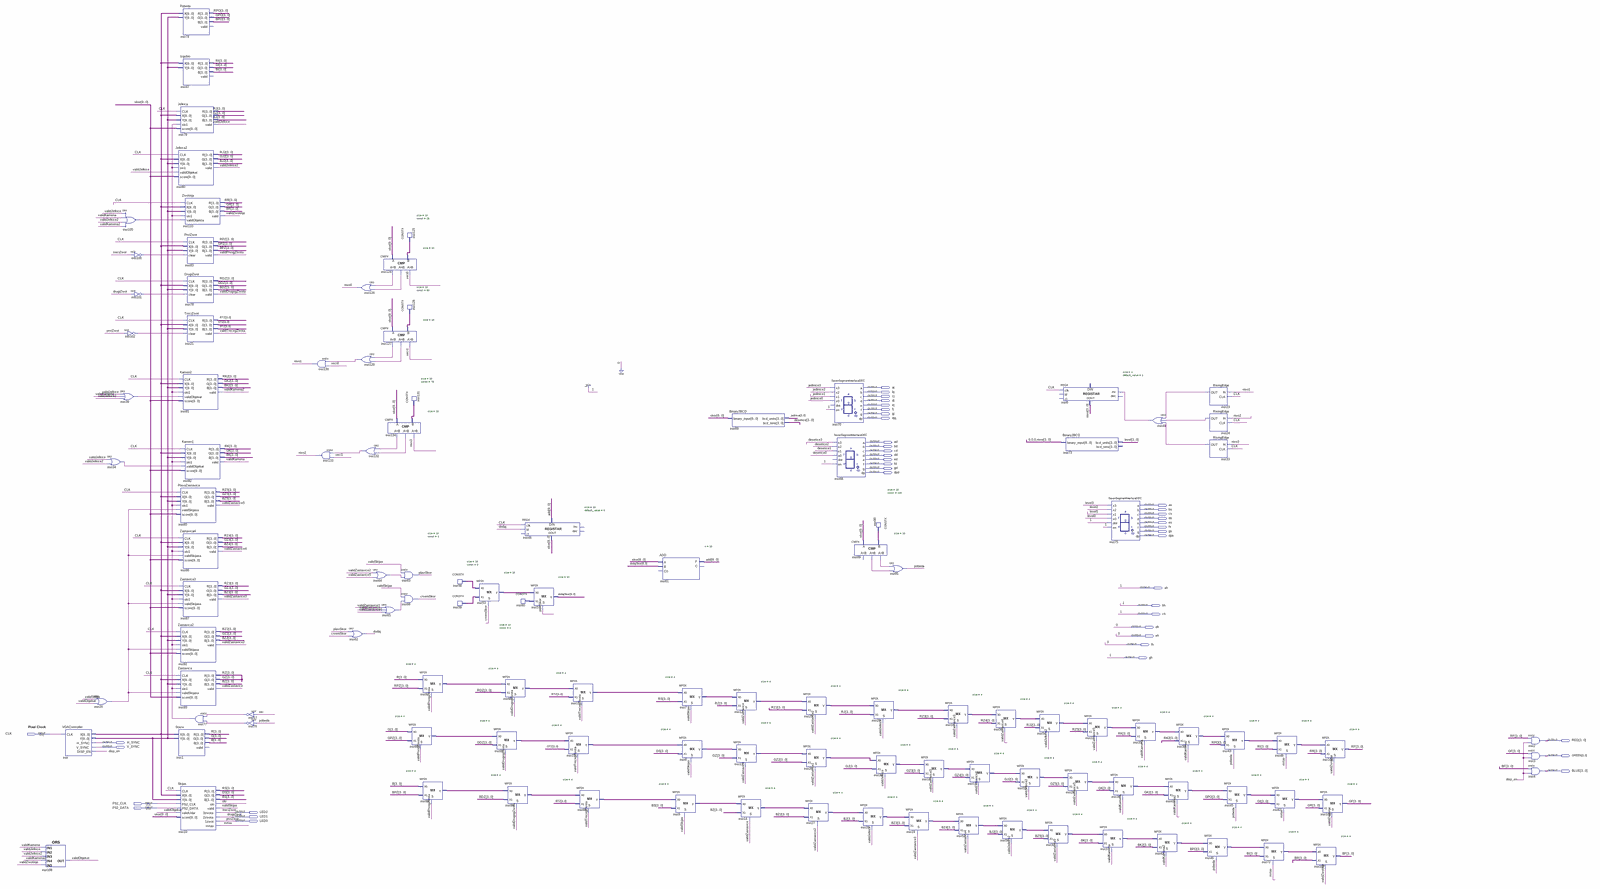
[diagram p0: schematic sheet, whole]
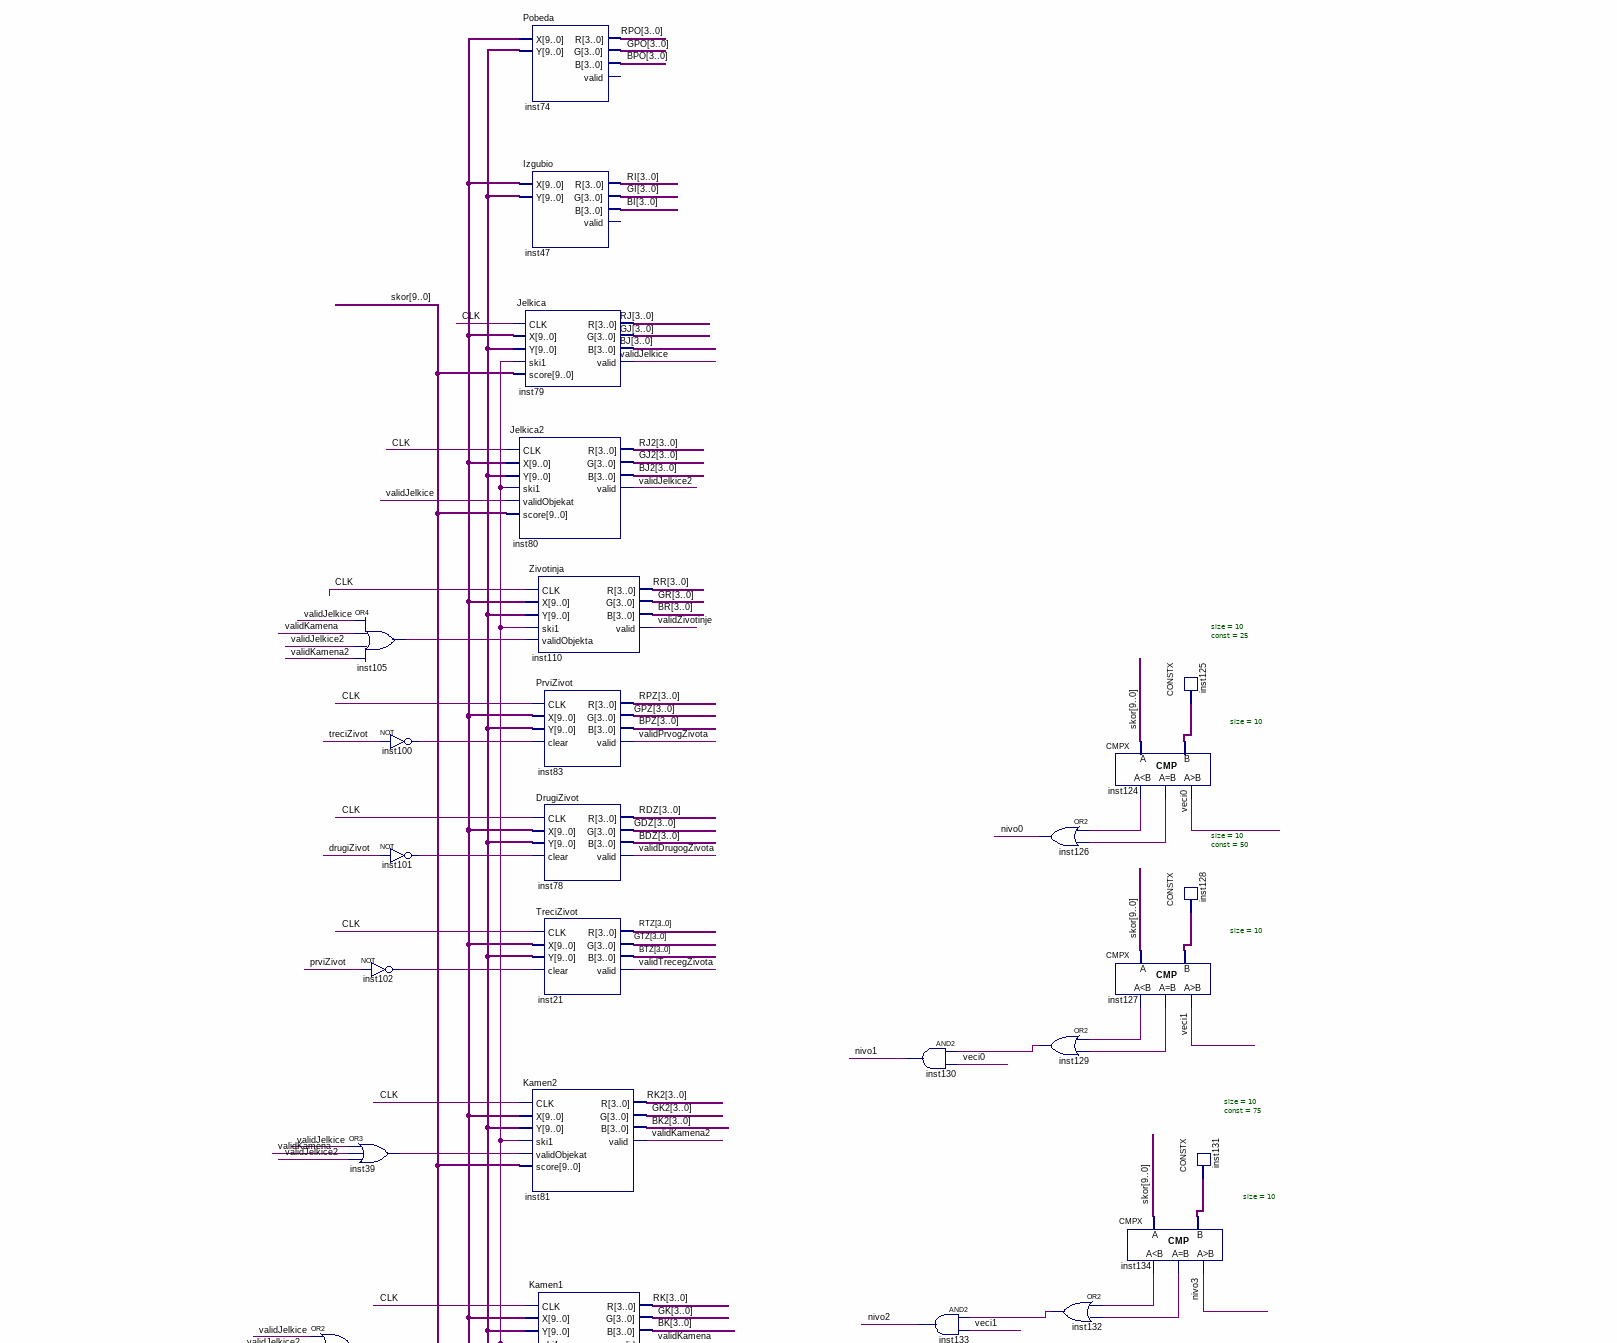
[diagram p1: schematic sheet, upper left part]
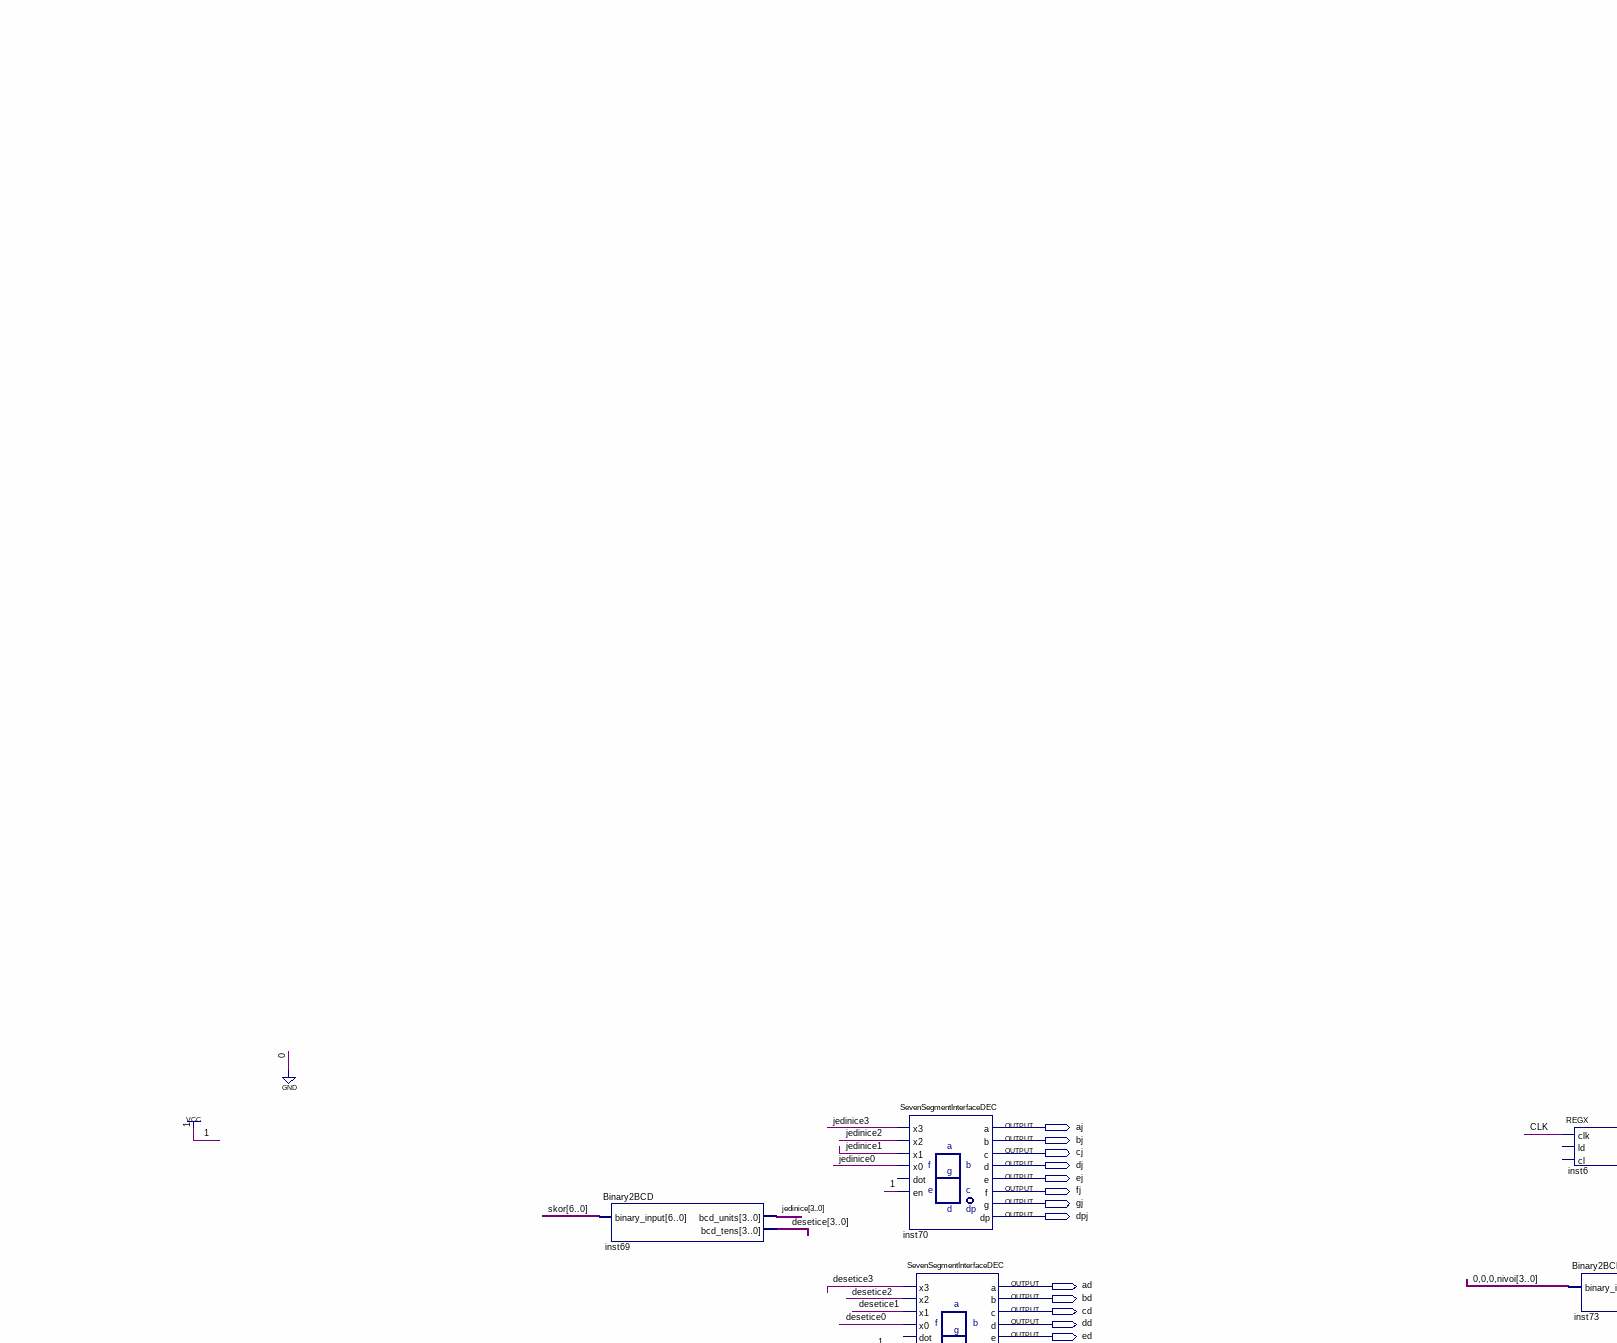
[diagram p2: schematic sheet, upper centre part]
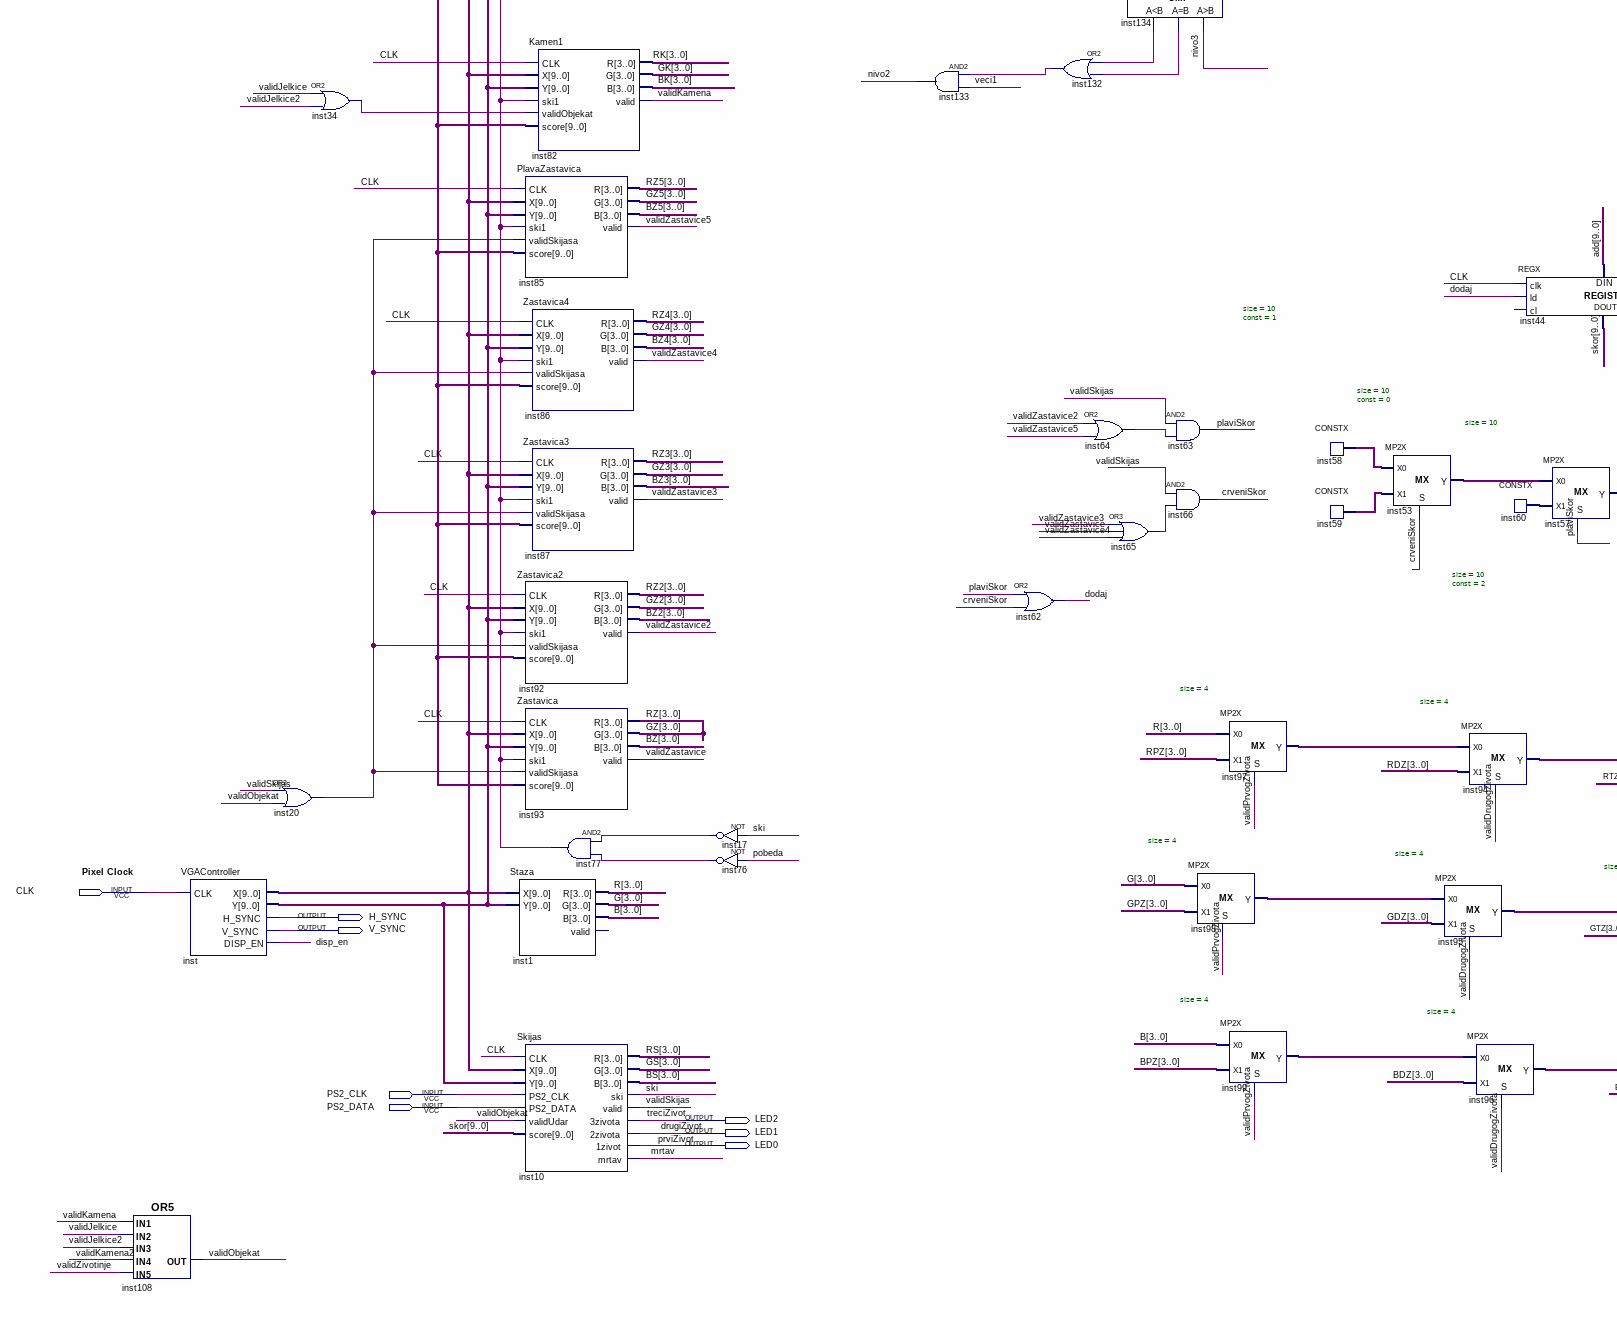
[diagram p3: schematic sheet, lower left part]
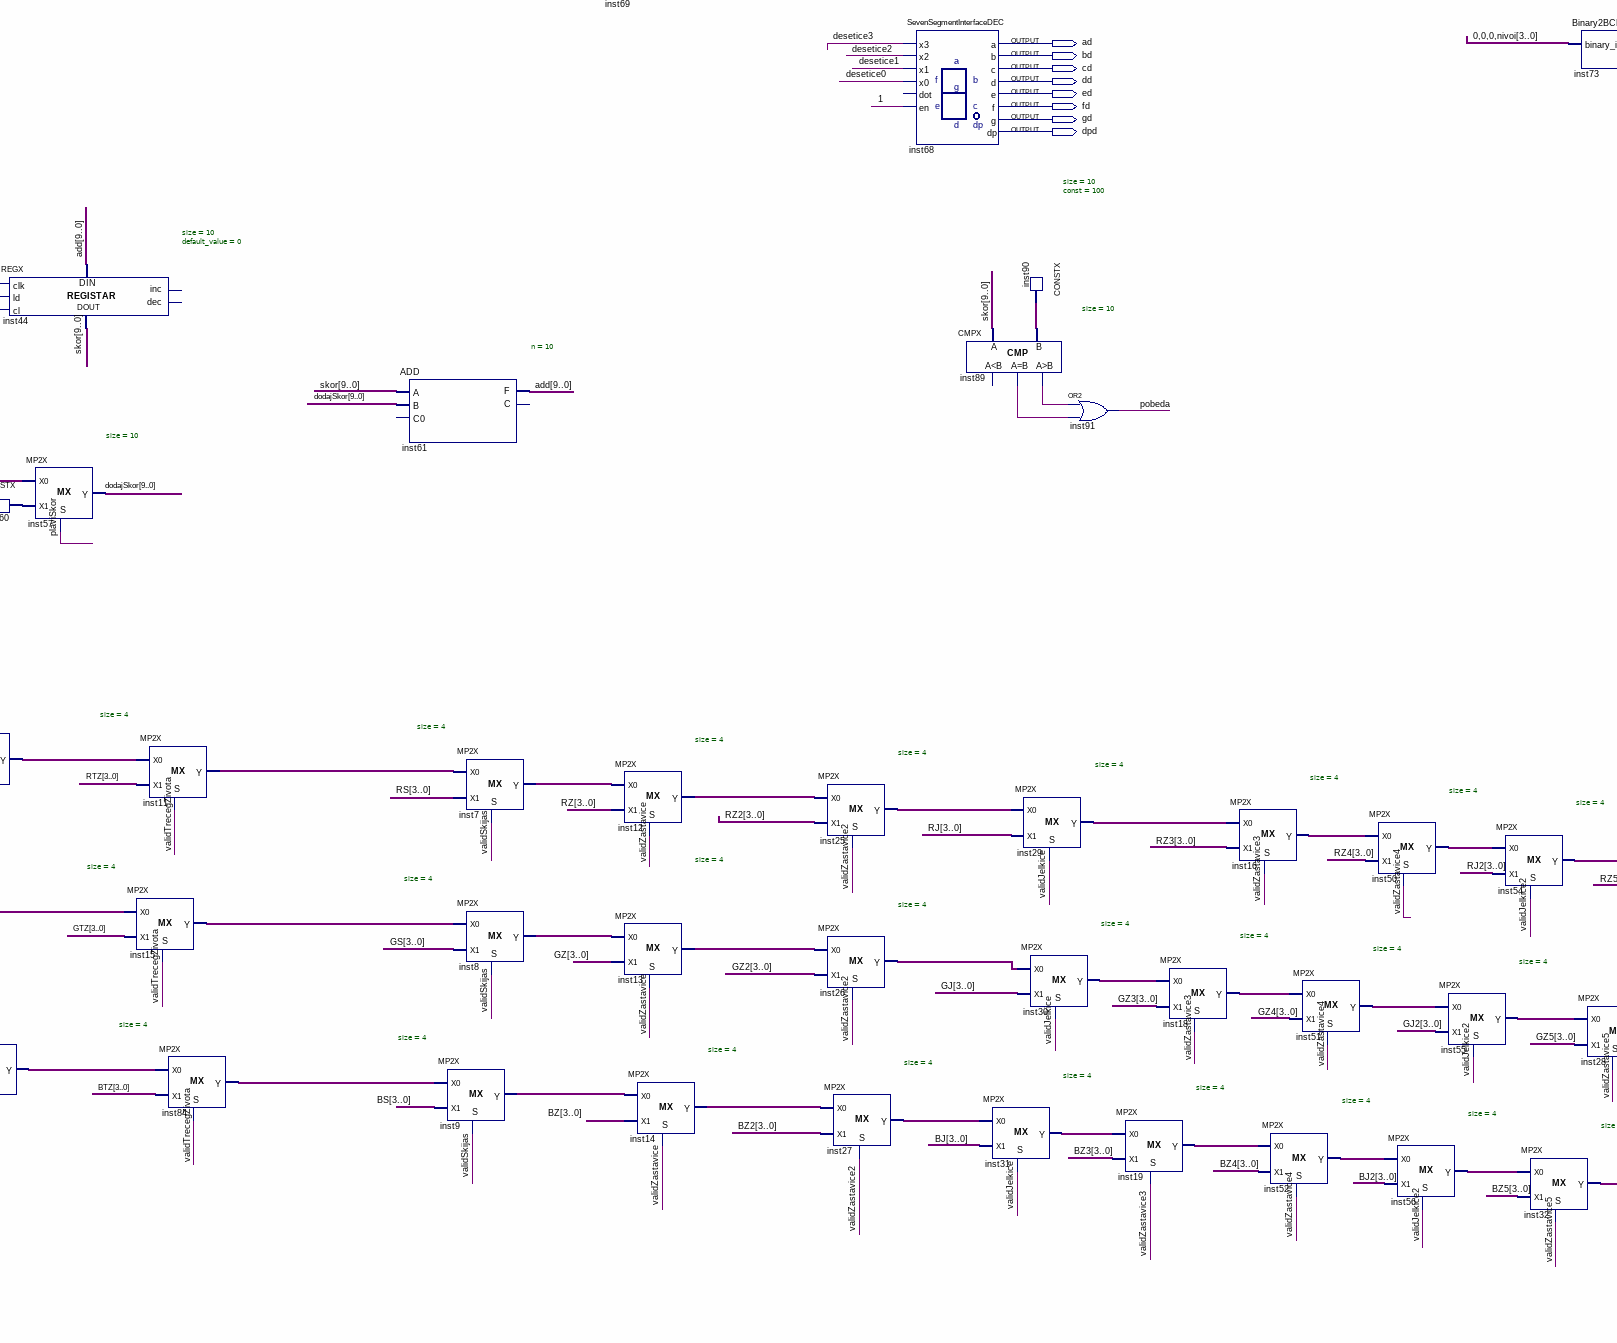
[diagram p4: schematic sheet, lower centre part]
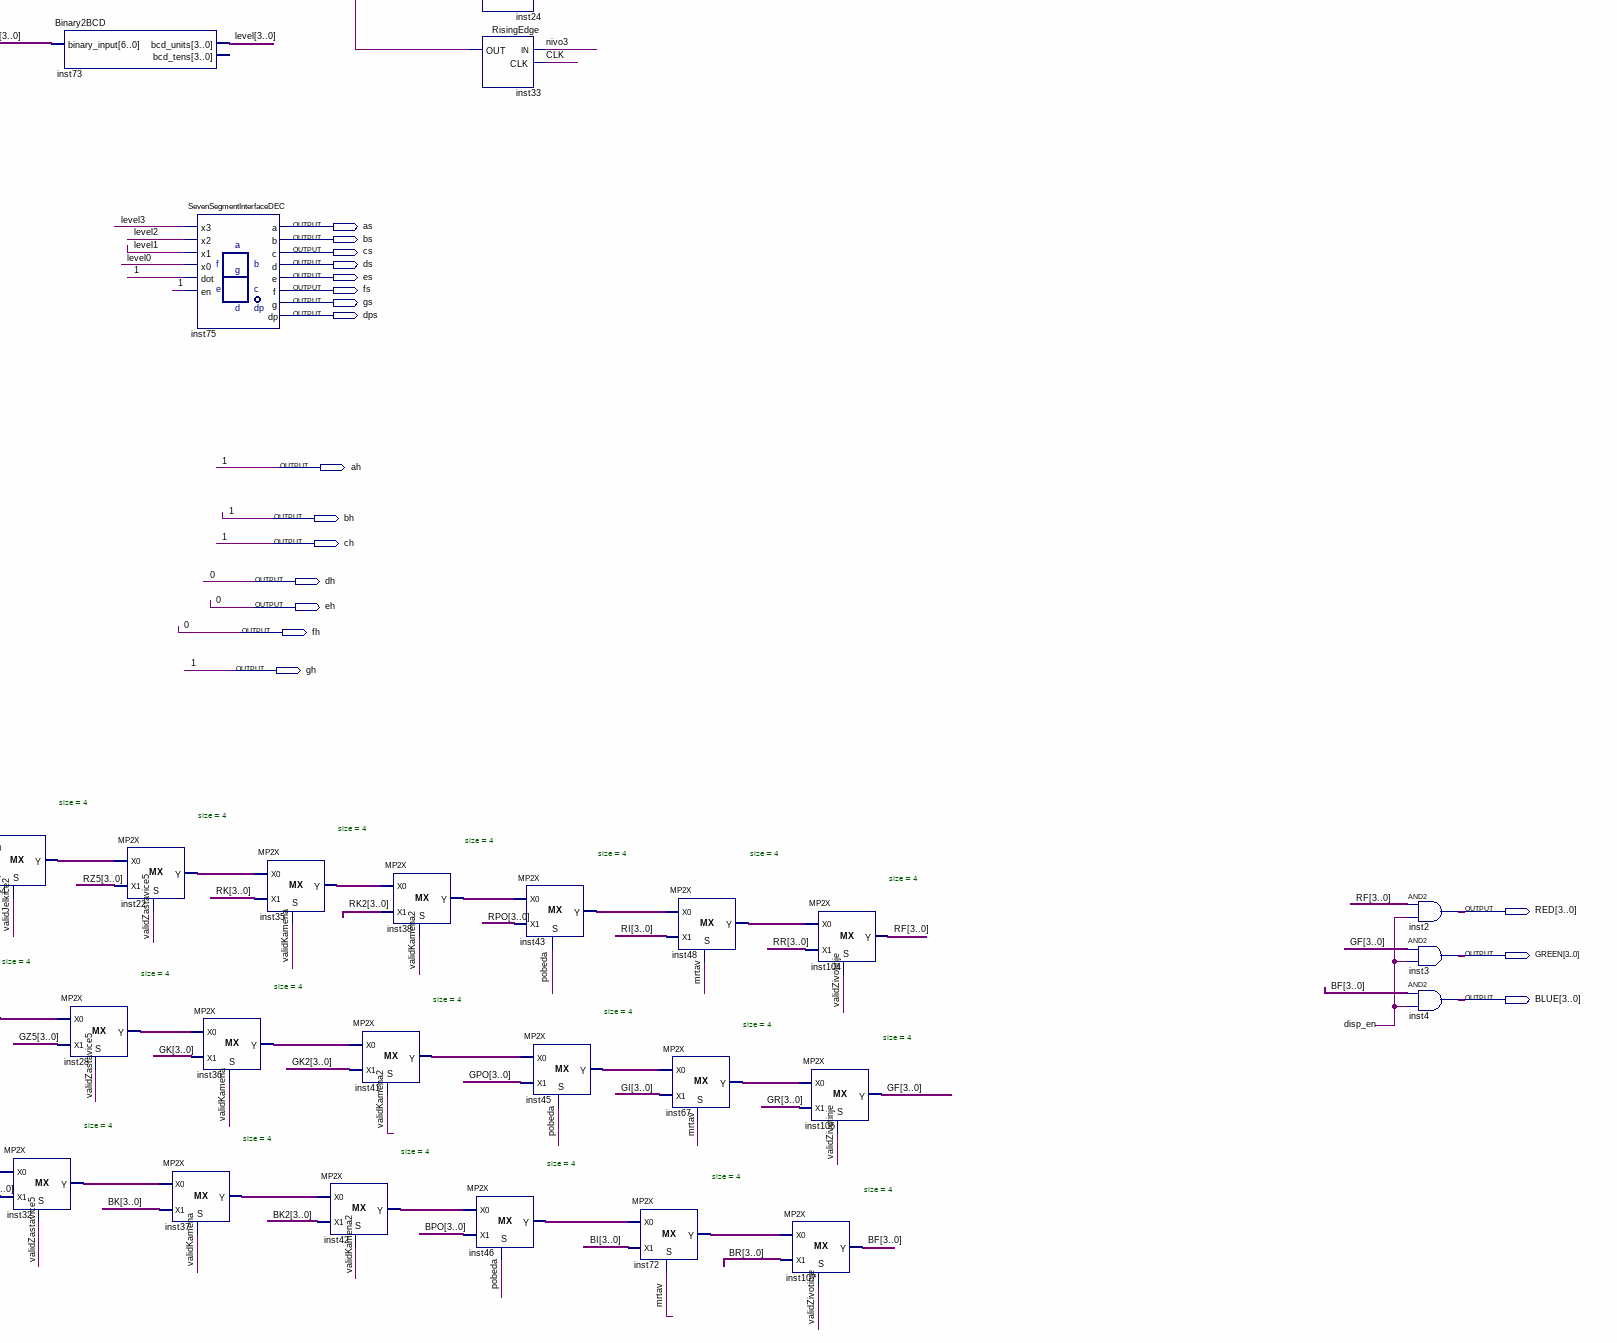
[diagram p5: schematic sheet, lower right part]
// Quartus schematic MainEkran.bdf as structural Verilog: 116 symbols, 42 pins
module MainEkran (
  input  CLK,
  input  PS2_CLK,
  input  PS2_DATA,
  output aj,
  output bj,
  output cj,
  output dj,
  output ej,
  output fj,
  output gj,
  output dpj,
  output ad,
  output bd,
  output cd,
  output dd,
  output ed,
  output fd,
  output gd,
  output dpd,
  output as,
  output bs,
  output cs,
  output ds,
  output es,
  output fs,
  output gs,
  output dps,
  output ah,
  output bh,
  output ch,
  output dh,
  output eh,
  output fh,
  output gh,
  output [3:0] RED,
  output H_SYNC,
  output V_SYNC,
  output [3:0] GREEN,
  output [3:0] BLUE,
  output LED2,
  output LED1,
  output LED0
);

  wire crveniSkor, disp_en, dodaj, inst17_out, inst20_out, inst23_out, inst24_out, inst33_out, inst34_out,
       inst39_out, inst49_out, inst64_out, inst65_out, inst76_out, inst77_out, inst89_eq, inst89_gr,
       inst100_out, inst101_out, inst102_out, inst105_out, inst124_eq, inst124_ls, inst127_eq, inst127_ls,
       inst129_out, inst132_out, inst134_eq, inst134_ls, mrtav, nivo0, nivo1, nivo2, nivo3, plaviSkor,
       pobeda, ski, validDrugogZivota, validJelkice, validJelkice2, validKamena, validKamena2, validObjekat,
       validPrvogZivota, validSkijas, validTrecegZivota, validZastavice, validZastavice2, validZastavice3,
       validZastavice4, validZastavice5, validZivotinje, veci0, veci1;
  wire [3:0] B, BDZ, BF, BI, BJ2, bj_bus, BK, BK2, BPO, BPZ, BR, bs_bus, BTZ, BZ, BZ2, BZ3, BZ4, BZ5,
       desetice, G, GDZ, GF, GI, GJ2, gj_bus, GK, GK2, GPO, GPZ, GR, gs_bus, GTZ, GZ, GZ2, GZ3, GZ4, GZ5,
       inst7_y, inst8_y, inst9_y, inst11_y, inst12_y, inst13_y, inst14_y, inst15_y, inst16_y, inst18_y,
       inst19_y, inst22_y, inst25_y, inst26_y, inst27_y, inst28_y, inst29_y, inst30_y, inst31_y, inst32_y,
       inst35_y, inst36_y, inst37_y, inst38_y, inst41_y, inst42_y, inst43_y, inst45_y, inst46_y, inst48_y,
       inst50_y, inst51_y, inst52_y, inst54_y, inst55_y, inst56_y, inst67_y, inst72_y, inst84_y, inst94_y,
       inst95_y, inst96_y, inst97_y, inst98_y, inst99_y, jedinice, level, nivoi, R, RDZ, RF, RI, RJ, RJ2, RK,
       RK2, RPO, RPZ, RR, RS, RTZ, RZ, RZ2, RZ3, RZ4, RZ5;
  wire [9:0] add, dodajSkor, inst53_y, inst58_data, inst59_data, inst60_data, inst90_data, inst125_data,
       inst128_data, inst131_data, inst_x, inst_y, skor;

  or inst108 (validObjekat, validKamena, validJelkice, validJelkice2, validKamena2, validZivotinje);
  VGAController inst (.CLK(CLK), .X(inst_x), .Y(inst_y), .H_SYNC(H_SYNC), .V_SYNC(V_SYNC), .DISP_EN(disp_en));
  or inst34 (inst34_out, validJelkice, validJelkice2);
  or inst20 (inst20_out, validSkijas, validObjekat);
  or inst105 (inst105_out, validJelkice, validKamena, validJelkice2, validKamena2);
  not inst102 (inst102_out, LED0);
  or inst39 (inst39_out, validJelkice, validKamena, validJelkice2);
  not inst100 (inst100_out, LED2);
  not inst101 (inst101_out, LED1);
  Pobeda inst74 (.X(inst_x), .Y(inst_y), .R(RPO), .G(GPO), .B(BPO));  // open: valid
  Izgubio inst47 (.X(inst_x), .Y(inst_y), .R(RI), .G(GI), .B(BI));  // open: valid
  Jelkica inst79 (
    .CLK(CLK), .X(inst_x), .Y(inst_y), .ski1(inst77_out), .score(skor), .R(RJ), .G(gj_bus), .B(bj_bus),
    .valid(validJelkice));
  Jelkica2 inst80 (
    .CLK(CLK), .X(inst_x), .Y(inst_y), .ski1(inst77_out), .validObjekat(validJelkice), .score(skor), .R(RJ2),
    .G(GJ2), .B(BJ2), .valid(validJelkice2));
  Kamen2 inst81 (
    .CLK(CLK), .X(inst_x), .Y(inst_y), .ski1(inst77_out), .validObjekat(inst39_out), .score(skor), .R(RK2),
    .G(GK2), .B(BK2), .valid(validKamena2));
  PlavaZastavica inst85 (
    .CLK(CLK), .X(inst_x), .Y(inst_y), .ski1(inst77_out), .validSkijasa(inst20_out), .score(skor), .R(RZ5),
    .G(GZ5), .B(BZ5), .valid(validZastavice5));
  Zastavica4 inst86 (
    .CLK(CLK), .X(inst_x), .Y(inst_y), .ski1(inst77_out), .validSkijasa(inst20_out), .score(skor), .R(RZ4),
    .G(GZ4), .B(BZ4), .valid(validZastavice4));
  Zastavica3 inst87 (
    .CLK(CLK), .X(inst_x), .Y(inst_y), .ski1(inst77_out), .validSkijasa(inst20_out), .score(skor), .R(RZ3),
    .G(GZ3), .B(BZ3), .valid(validZastavice3));
  Zastavica2 inst92 (
    .CLK(CLK), .X(inst_x), .Y(inst_y), .ski1(inst77_out), .validSkijasa(inst20_out), .score(skor), .R(RZ2),
    .G(GZ2), .B(BZ2), .valid(validZastavice2));
  Zastavica inst93 (
    .CLK(CLK), .X(inst_x), .Y(inst_y), .ski1(inst77_out), .validSkijasa(inst20_out), .score(skor), .R(RZ),
    .G(GZ), .B(BZ), .valid(validZastavice));
  Staza inst1 (.X(inst_x), .Y(inst_y), .R(R), .G(G), .B(B));  // open: valid
  Skijas inst10 (
    .CLK(CLK), .X(inst_x), .Y(inst_y), .PS2_CLK(PS2_CLK), .PS2_DATA(PS2_DATA), .validUdar(validObjekat),
    .score(skor), .R(RS), .G(gs_bus), .B(bs_bus), .ski(ski), .valid(validSkijas), .\3zivota (LED2),
    .\2zivota (LED1), .\1zivot (LED0), .mrtav(mrtav));
  Zivotinja inst110 (
    .CLK(CLK), .X(inst_x), .Y(inst_y), .ski1(inst77_out), .validObjekta(inst105_out), .R(RR), .G(GR), .B(BR),
    .valid(validZivotinje));
  PrviZivot inst83 (
    .CLK(CLK), .X(inst_x), .Y(inst_y), .clear(inst100_out), .R(RPZ), .G(GPZ), .B(BPZ),
    .valid(validPrvogZivota));
  DrugiZivot inst78 (
    .CLK(CLK), .X(inst_x), .Y(inst_y), .clear(inst101_out), .R(RDZ), .G(GDZ), .B(BDZ),
    .valid(validDrugogZivota));
  TreciZivot inst21 (
    .CLK(CLK), .X(inst_x), .Y(inst_y), .clear(inst102_out), .R(RTZ), .G(GTZ), .B(BTZ),
    .valid(validTrecegZivota));
  Kamen1 inst82 (
    .CLK(CLK), .X(inst_x), .Y(inst_y), .ski1(inst77_out), .validObjekat(inst34_out), .score(skor), .R(RK),
    .G(GK), .B(BK), .valid(validKamena));
  and inst77 (inst77_out, inst17_out, inst76_out);
  not inst17 (inst17_out, ski);
  not inst76 (inst76_out, pobeda);
  and inst130 (nivo1, inst129_out, veci0);
  and inst133 (nivo2, inst132_out, veci1);
  or inst62 (dodaj, plaviSkor, crveniSkor);
  or inst126 (nivo0, inst124_ls, inst124_eq);
  or inst129 (inst129_out, inst127_ls, inst127_eq);
  or inst132 (inst132_out, inst134_ls, inst134_eq);
  CMPX #(.size(10)) inst124 (.A(skor), .B(inst125_data), .ls(inst124_ls), .eq(inst124_eq), .gr(veci0));
  CMPX #(.size(10)) inst127 (.A(skor), .B(inst128_data), .ls(inst127_ls), .eq(inst127_eq), .gr(veci1));
  CMPX #(.size(10)) inst134 (.A(skor), .B(inst131_data), .ls(inst134_ls), .eq(inst134_eq), .gr(nivo3));
  or inst64 (inst64_out, validZastavice2, validZastavice5);
  or inst65 (inst65_out, validZastavice3, validZastavice, validZastavice4);
  CONSTX #(.size(10), .\const (25)) inst125 (.data(inst125_data));
  CONSTX #(.size(10), .\const (50)) inst128 (.data(inst128_data));
  CONSTX #(.size(10), .\const (75)) inst131 (.data(inst131_data));
  and inst63 (plaviSkor, validSkijas, inst64_out);
  and inst66 (crveniSkor, validSkijas, inst65_out);
  MP2X #(.size(4)) inst97 (.S(validPrvogZivota), .X0(R), .X1(RPZ), .Y(inst97_y));
  MP2X #(.size(4)) inst98 (.S(validPrvogZivota), .X0(G), .X1(GPZ), .Y(inst98_y));
  MP2X #(.size(4)) inst99 (.S(validPrvogZivota), .X0(B), .X1(BPZ), .Y(inst99_y));
  CONSTX #(.size(10), .\const (0)) inst58 (.data(inst58_data));
  CONSTX #(.size(10), .\const (1)) inst59 (.data(inst59_data));
  MP2X #(.size(10)) inst53 (.S(crveniSkor), .X0(inst58_data), .X1(inst59_data), .Y(inst53_y));
  MP2X #(.size(4)) inst95 (.S(validDrugogZivota), .X0(inst98_y), .X1(GDZ), .Y(inst95_y));
  MP2X #(.size(4)) inst94 (.S(validDrugogZivota), .X0(inst97_y), .X1(RDZ), .Y(inst94_y));
  MP2X #(.size(4)) inst96 (.S(validDrugogZivota), .X0(inst99_y), .X1(BDZ), .Y(inst96_y));
  REGX #(.size(10), .default_value(0)) inst44 (
    .clk(CLK), .ld(dodaj), .data_in(add), .data_out(skor));  // open: cl, inc, dec
  CONSTX #(.size(10), .\const (2)) inst60 (.data(inst60_data));
  MP2X #(.size(10)) inst57 (.S(plaviSkor), .X0(inst53_y), .X1(inst60_data), .Y(dodajSkor));
  MP2X #(.size(4)) inst11 (.S(validTrecegZivota), .X0(inst94_y), .X1(RTZ), .Y(inst11_y));
  MP2X #(.size(4)) inst15 (.S(validTrecegZivota), .X0(inst95_y), .X1(GTZ), .Y(inst15_y));
  MP2X #(.size(4)) inst84 (.S(validTrecegZivota), .X0(inst96_y), .X1(BTZ), .Y(inst84_y));
  ADD #(.n(10)) inst61 (.A(skor), .B(dodajSkor), .F(add));  // open: C0, C
  MP2X #(.size(4)) inst7 (.S(validSkijas), .X0(inst11_y), .X1(RS), .Y(inst7_y));
  MP2X #(.size(4)) inst8 (.S(validSkijas), .X0(inst15_y), .X1(gs_bus), .Y(inst8_y));
  MP2X #(.size(4)) inst9 (.S(validSkijas), .X0(inst84_y), .X1(bs_bus), .Y(inst9_y));
  Binary2BCD inst69 (.binary_input(skor[6:0]), .bcd_units(jedinice), .bcd_tens(desetice));
  MP2X #(.size(4)) inst12 (.S(validZastavice), .X0(inst7_y), .X1(RZ), .Y(inst12_y));
  MP2X #(.size(4)) inst13 (.S(validZastavice), .X0(inst8_y), .X1(GZ), .Y(inst13_y));
  MP2X #(.size(4)) inst14 (.S(validZastavice), .X0(inst9_y), .X1(BZ), .Y(inst14_y));
  MP2X #(.size(4)) inst25 (.S(validZastavice2), .X0(inst12_y), .X1(RZ2), .Y(inst25_y));
  MP2X #(.size(4)) inst26 (.S(validZastavice2), .X0(inst13_y), .X1(GZ2), .Y(inst26_y));
  MP2X #(.size(4)) inst27 (.S(validZastavice2), .X0(inst14_y), .X1(BZ2), .Y(inst27_y));
  SevenSegmentInterfaceDEC inst70 (
    .x3(jedinice[3]), .x2(jedinice[2]), .x1(jedinice[1]), .x0(jedinice[0]), .en(1'b1), .a(aj), .b(bj),
    .c(cj), .d(dj), .e(ej), .f(fj), .g(gj), .dp(dpj));  // open: dot
  SevenSegmentInterfaceDEC inst68 (
    .x3(desetice[3]), .x2(desetice[2]), .x1(desetice[1]), .x0(desetice[0]), .en(1'b1), .a(ad), .b(bd),
    .c(cd), .d(dd), .e(ed), .f(fd), .g(gd), .dp(dpd));  // open: dot
  CMPX #(.size(10)) inst89 (.A(skor), .B(inst90_data), .eq(inst89_eq), .gr(inst89_gr));  // open: ls
  MP2X #(.size(4)) inst31 (.S(validJelkice), .X0(inst27_y), .X1(bj_bus), .Y(inst31_y));
  CONSTX #(.size(10), .\const (100)) inst90 (.data(inst90_data));
  MP2X #(.size(4)) inst29 (.S(validJelkice), .X0(inst25_y), .X1(RJ), .Y(inst29_y));
  MP2X #(.size(4)) inst30 (.S(validJelkice), .X0(inst26_y), .X1(gj_bus), .Y(inst30_y));
  or inst91 (pobeda, inst89_gr, inst89_eq);
  MP2X #(.size(4)) inst19 (.S(validZastavice3), .X0(inst31_y), .X1(BZ3), .Y(inst19_y));
  MP2X #(.size(4)) inst18 (.S(validZastavice3), .X0(inst30_y), .X1(GZ3), .Y(inst18_y));
  MP2X #(.size(4)) inst16 (.S(validZastavice3), .X0(inst29_y), .X1(RZ3), .Y(inst16_y));
  MP2X #(.size(4)) inst52 (.S(validZastavice4), .X0(inst19_y), .X1(BZ4), .Y(inst52_y));
  MP2X #(.size(4)) inst51 (.S(validZastavice4), .X0(inst18_y), .X1(GZ4), .Y(inst51_y));
  MP2X #(.size(4)) inst50 (.S(validZastavice4), .X0(inst16_y), .X1(RZ4), .Y(inst50_y));
  MP2X #(.size(4)) inst56 (.S(validJelkice2), .X0(inst52_y), .X1(BJ2), .Y(inst56_y));
  MP2X #(.size(4)) inst55 (.S(validJelkice2), .X0(inst51_y), .X1(GJ2), .Y(inst55_y));
  MP2X #(.size(4)) inst54 (.S(validJelkice2), .X0(inst50_y), .X1(RJ2), .Y(inst54_y));
  MP2X #(.size(4)) inst32 (.S(validZastavice5), .X0(inst56_y), .X1(BZ5), .Y(inst32_y));
  REGX #(.size(4), .default_value(1)) inst6 (
    .clk(CLK), .inc(inst49_out), .data_out(nivoi));  // open: ld, cl, dec, data_in
  Binary2BCD inst73 (.binary_input({3'b000, nivoi}), .bcd_units(level));  // open: bcd_tens
  MP2X #(.size(4)) inst28 (.S(validZastavice5), .X0(inst55_y), .X1(GZ5), .Y(inst28_y));
  MP2X #(.size(4)) inst22 (.S(validZastavice5), .X0(inst54_y), .X1(RZ5), .Y(inst22_y));
  MP2X #(.size(4)) inst37 (.S(validKamena), .X0(inst32_y), .X1(BK), .Y(inst37_y));
  SevenSegmentInterfaceDEC inst75 (
    .x3(level[3]), .x2(level[2]), .x1(level[1]), .x0(level[0]), .dot(1'b1), .en(1'b1), .a(as), .b(bs),
    .c(cs), .d(ds), .e(es), .f(fs), .g(gs), .dp(dps));
  MP2X #(.size(4)) inst36 (.S(validKamena), .X0(inst28_y), .X1(GK), .Y(inst36_y));
  MP2X #(.size(4)) inst35 (.S(validKamena), .X0(inst22_y), .X1(RK), .Y(inst35_y));
  or inst49 (inst49_out, inst23_out, inst24_out, inst33_out);
  MP2X #(.size(4)) inst42 (.S(validKamena2), .X0(inst37_y), .X1(BK2), .Y(inst42_y));
  MP2X #(.size(4)) inst41 (.S(validKamena2), .X0(inst36_y), .X1(GK2), .Y(inst41_y));
  MP2X #(.size(4)) inst38 (.S(validKamena2), .X0(inst35_y), .X1(RK2), .Y(inst38_y));
  RisingEdge inst23 (.IN(nivo1), .CLK(CLK), .OUT(inst23_out));
  RisingEdge inst24 (.IN(nivo2), .CLK(CLK), .OUT(inst24_out));
  RisingEdge inst33 (.IN(nivo3), .CLK(CLK), .OUT(inst33_out));
  MP2X #(.size(4)) inst46 (.S(pobeda), .X0(inst42_y), .X1(BPO), .Y(inst46_y));
  MP2X #(.size(4)) inst43 (.S(pobeda), .X0(inst38_y), .X1(RPO), .Y(inst43_y));
  MP2X #(.size(4)) inst45 (.S(pobeda), .X0(inst41_y), .X1(GPO), .Y(inst45_y));
  MP2X #(.size(4)) inst72 (.S(mrtav), .X0(inst46_y), .X1(BI), .Y(inst72_y));
  MP2X #(.size(4)) inst48 (.S(mrtav), .X0(inst43_y), .X1(RI), .Y(inst48_y));
  MP2X #(.size(4)) inst67 (.S(mrtav), .X0(inst45_y), .X1(GI), .Y(inst67_y));
  MP2X #(.size(4)) inst107 (.S(validZivotinje), .X0(inst72_y), .X1(BR), .Y(BF));
  MP2X #(.size(4)) inst104 (.S(validZivotinje), .X0(inst48_y), .X1(RR), .Y(RF));
  MP2X #(.size(4)) inst106 (.S(validZivotinje), .X0(inst67_y), .X1(GR), .Y(GF));
  assign RED = RF & {4{disp_en}};  // AND2 inst2, 4 bits wide
  assign GREEN = GF & {4{disp_en}};  // AND2 inst3, 4 bits wide
  assign BLUE = BF & {4{disp_en}};  // AND2 inst4, 4 bits wide

  assign ah = 1'b1;
  assign bh = 1'b1;
  assign ch = 1'b1;
  assign dh = 1'b0;
  assign eh = 1'b0;
  assign fh = 1'b0;
  assign gh = 1'b1;

  // Other names for the same wires on the sheet: drugiZivot = LED1; prviZivot = LED0; treciZivot = LED2

  // Notes on the sheet:
  //   Pixel Clock
endmodule
